# EAGLE schematic ModuleCarrier-Murata-ABZ-v1.0.0 (EAGLE 7.7.0)

## Sheet 1 of 2
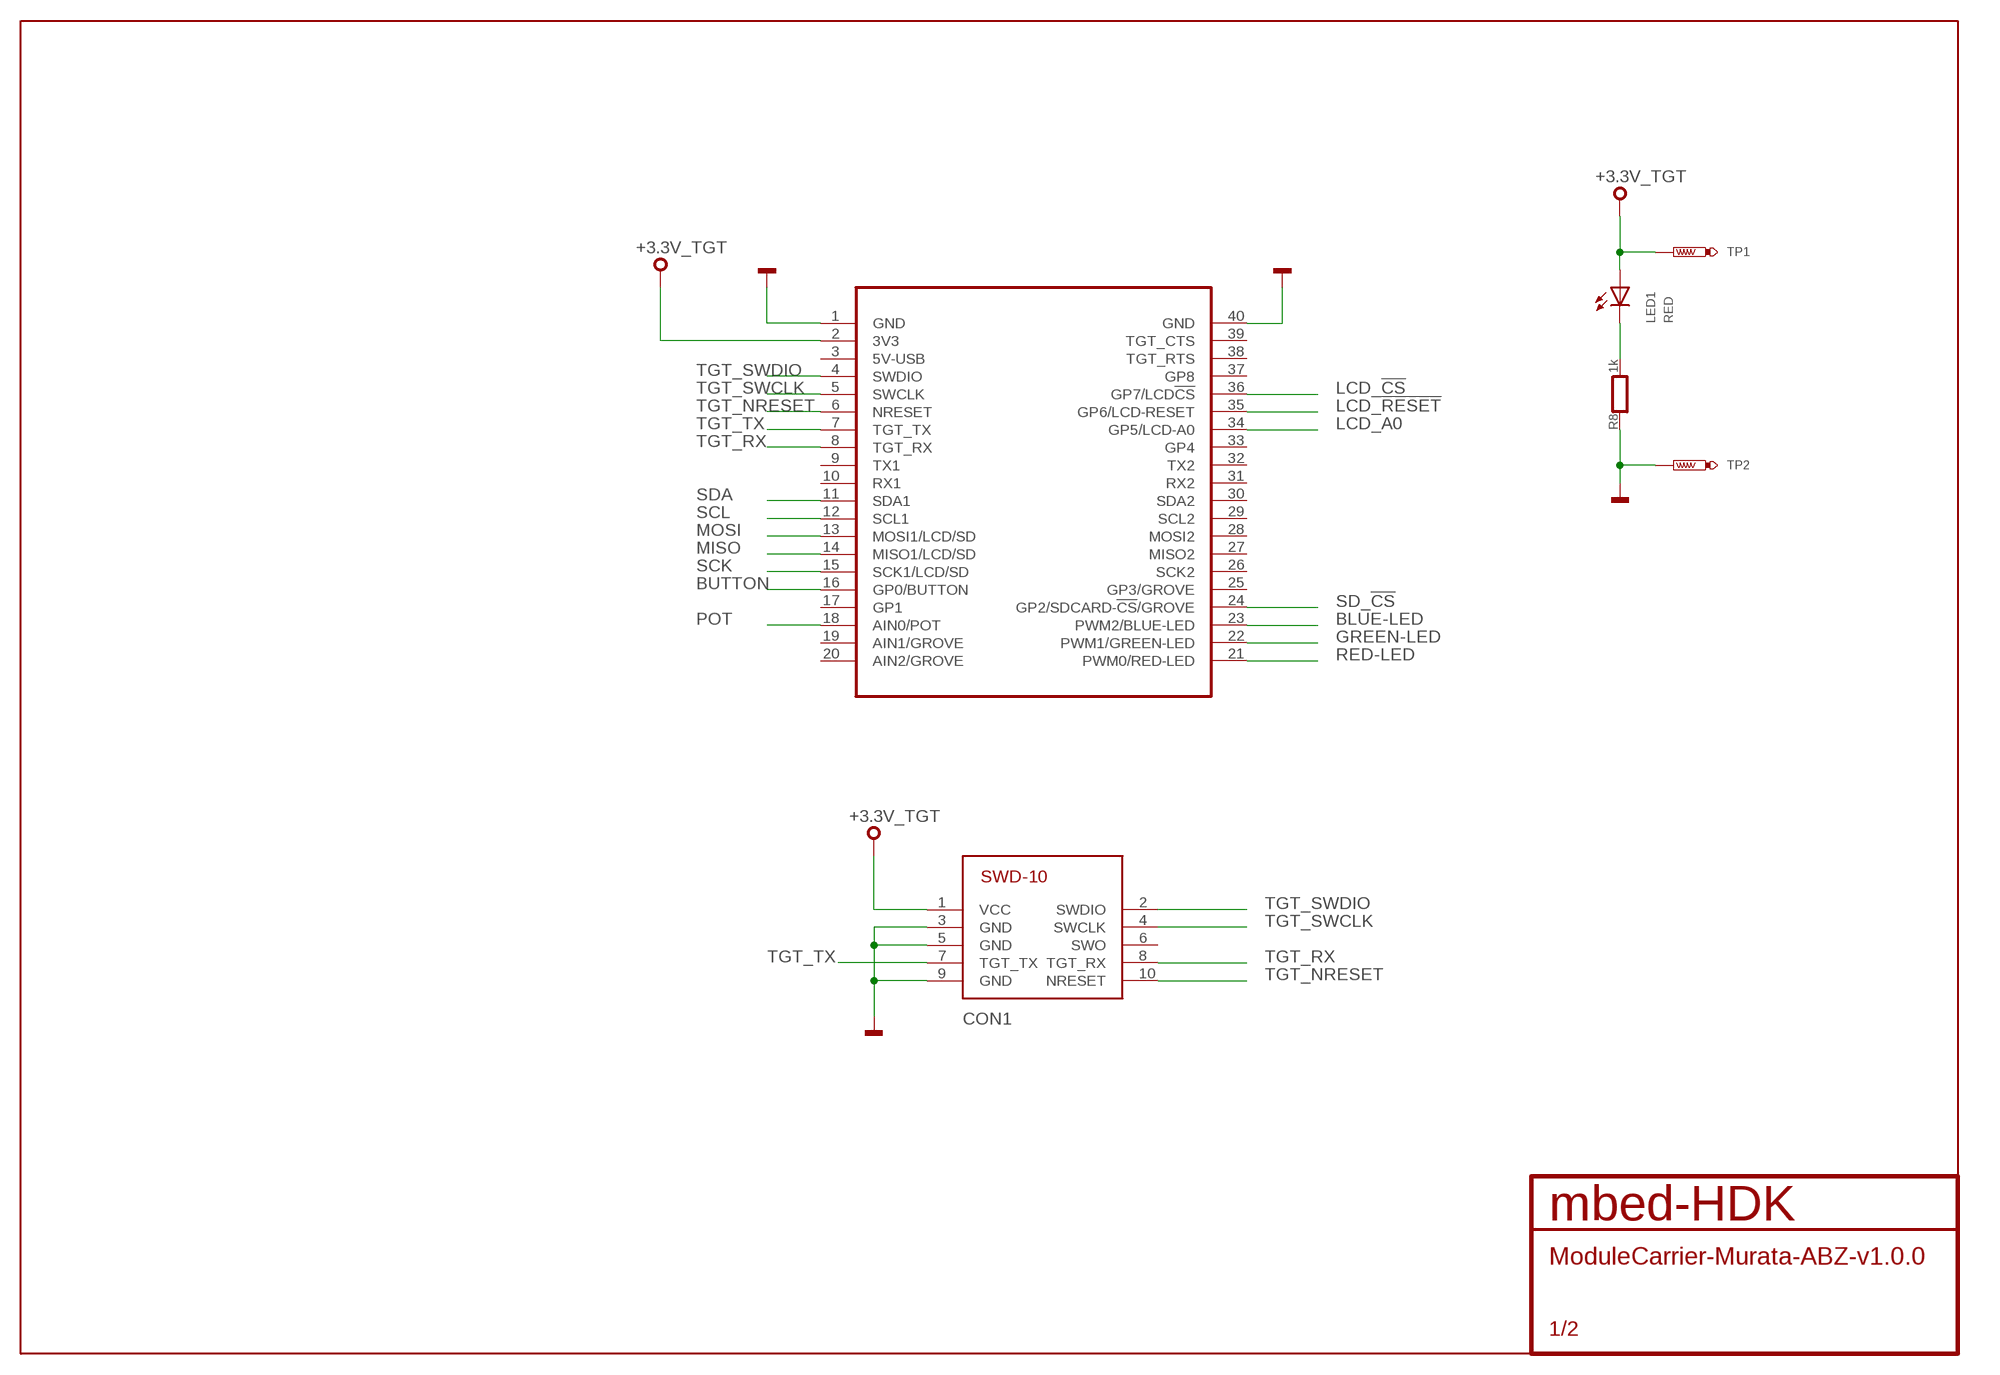
[diagram p0: schematic, sheet 1]

### Parts
CON1  SWD-10/TC2050_SMD  [FTSH-105-02]
LED1  RED  SMD_LED0603  [CHIPLED_0603]
MOD1  MODULE_DAUGHTER  [MODULE_DAUGHTER]
R8  1k  RESISTOR0603  [0603]
TP1  TEST-POINT-50R-PTH  [TP50-PTH]
TP2  TEST-POINT-50R-PTH  [TP50-PTH]

### Nets
+3.3V_TGT: CON1.1(VCC) LED1.A MOD1.2(3V3) TP1.TP ; also sheet 2
BLUE-LED: MOD1.23(PWM2/BLUE-LED) ; also sheet 2
BUTTON: MOD1.16(GP0/BUTTON) ; also sheet 2
GND: CON1.3(GND) CON1.5(GND) CON1.9(GND) MOD1.1(GND) MOD1.40(GND) R8.1 TP2.TP ; also sheet 2
GREEN-LED: MOD1.22(PWM1/GREEN-LED) ; also sheet 2
LCD_!CS: MOD1.36(GP7/LCD!CS) ; also sheet 2
LCD_!RESET: MOD1.35(GP6/LCD-RESET) ; also sheet 2
LCD_A0: MOD1.34(GP5/LCD-A0) ; also sheet 2
MISO: MOD1.14(MISO1/LCD/SD) ; also sheet 2
MOSI: MOD1.13(MOSI1/LCD/SD) ; also sheet 2
PA_1: LED1.C R8.2
POT: MOD1.18(AIN0/POT) ; also sheet 2
RED-LED: MOD1.21(PWM0/RED-LED) ; also sheet 2
SCK: MOD1.15(SCK1/LCD/SD) ; also sheet 2
SCL: MOD1.12(SCL1) ; also sheet 2
SD_!CS: MOD1.24(GP2/SDCARD-!CS!/GROVE) ; also sheet 2
SDA: MOD1.11(SDA1) ; also sheet 2
TGT_NRESET: CON1.10(NRESET) MOD1.6(NRESET) ; also sheet 2
TGT_RX: CON1.8(TGT_RX) MOD1.8(TGT_RX) ; also sheet 2
TGT_SWCLK: CON1.4(SWCLK) MOD1.5(SWCLK) ; also sheet 2
TGT_SWDIO: CON1.2(SWDIO) MOD1.4(SWDIO) ; also sheet 2
TGT_TX: CON1.7(TGT_TX) MOD1.7(TGT_TX) ; also sheet 2
Unconnected: CON1.6(SWO) MOD1.3(5V-USB) MOD1.9(TX1) MOD1.10(RX1) MOD1.17(GP1) MOD1.19(AIN1/GROVE) MOD1.20(AIN2/GROVE) MOD1.25(GP3/GROVE) MOD1.26(SCK2) MOD1.27(MISO2) MOD1.28(MOSI2) MOD1.29(SCL2) MOD1.30(SDA2) MOD1.31(RX2) MOD1.32(TX2) MOD1.33(GP4) MOD1.37(GP8) MOD1.38(TGT_RTS) MOD1.39(TGT_CTS)

## Sheet 2 of 2
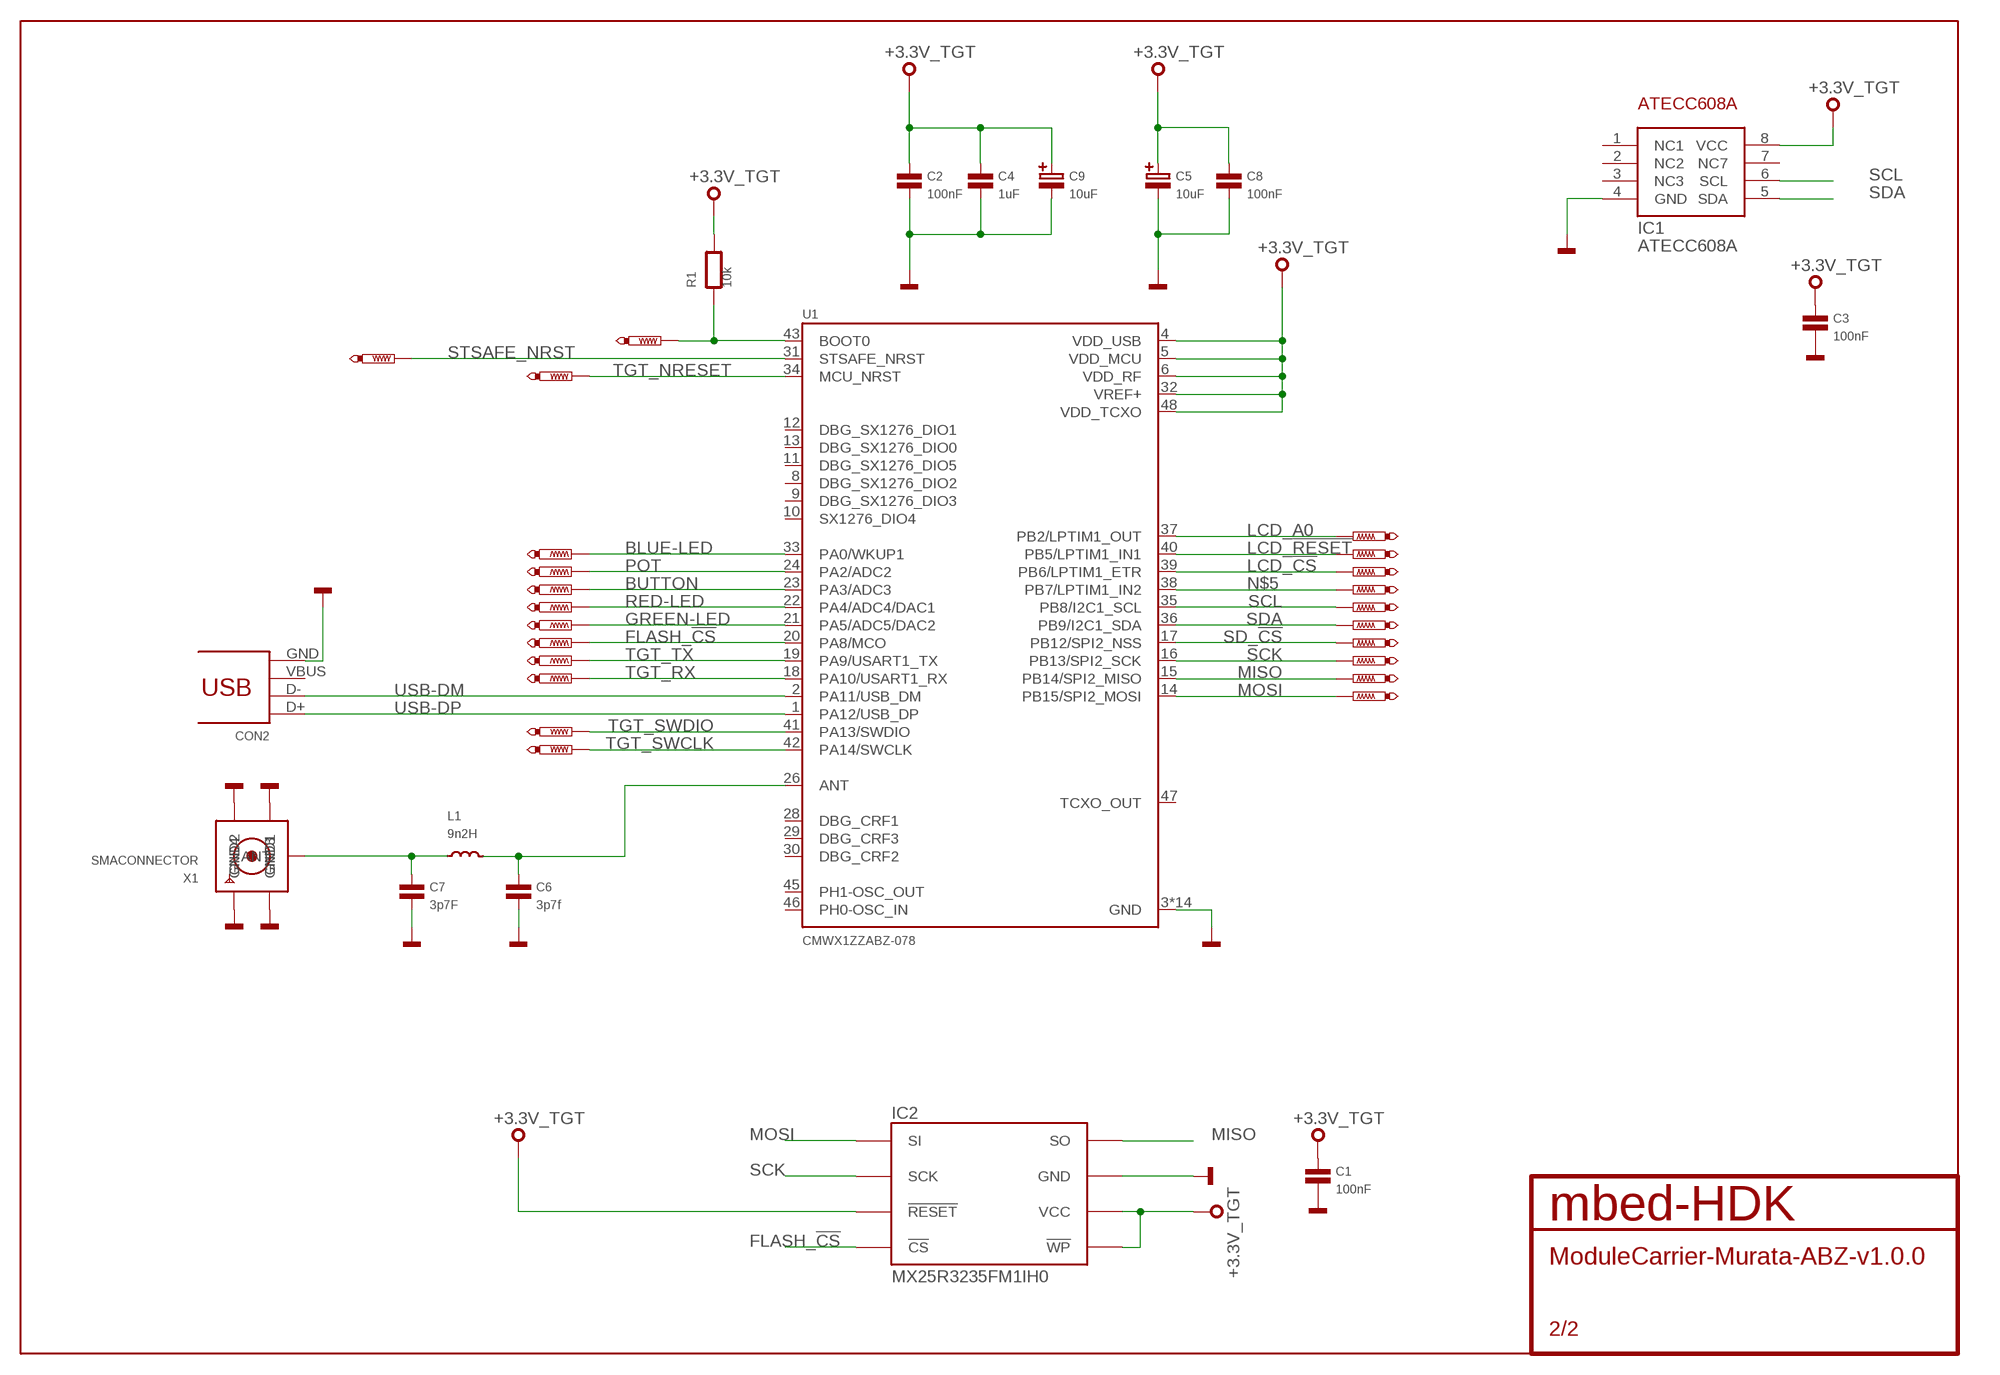
[diagram p1: schematic, sheet 2]

### Parts
C1  100nF  CAPACITOR0603  [0603]
C2  100nF  CAPACITOR0603  [0603]
C3  100nF  CAPACITOR0603  [0603]
C4  1uF  CAPACITOR0603  [0603]
C5  10uF  CAPACITOR-POLARISEDB  [SMC_B]
C6  3p7f  CAPACITOR0603  [0603]
C7  3p7F  CAPACITOR0603  [0603]
C8  100nF  CAPACITOR0603  [0603]
C9  10uF  CAPACITOR-POLARISEDB  [SMC_B]
CON2  10033526-N3212MLF  [USB-MINI-B-H]
IC1  ATECC608A  [SO8]
IC2  MX25R3235FM1IH0  [SO8]
L1  9n2H  INDUCTOR0603  [0603]
R1  10k  RESISTOR0603  [0603]
TP3  PTR1TP08R  [TP08R]
TP4  PTR1TP08R  [TP08R]
TP5  PTR1TP08R  [TP08R]
TP6  PTR1TP08R  [TP08R]
TP7  PTR1TP08R  [TP08R]
TP8  PTR1TP08R  [TP08R]
TP9  PTR1TP08R  [TP08R]
TP10  PTR1TP08R  [TP08R]
TP11  PTR1TP08R  [TP08R]
TP12  PTR1TP08R  [TP08R]
TP13  PTR1TP08R  [TP08R]
TP14  PTR1TP08R  [TP08R]
TP15  PTR1TP08R  [TP08R]
TP21  PTR1TP08R  [TP08R]
TP22  PTR1TP08R  [TP08R]
TP23  PTR1TP08R  [TP08R]
TP24  PTR1TP08R  [TP08R]
TP25  PTR1TP08R  [TP08R]
TP26  PTR1TP08R  [TP08R]
TP27  PTR1TP08R  [TP08R]
TP28  PTR1TP08R  [TP08R]
TP29  PTR1TP08R  [TP08R]
TP30  PTR1TP08R  [TP08R]
U1  CMWX1ZZABZ-078  [XCVR_CMWX1ZZABZ-078]
X1  SMACONNECTOR  [SMA90_DIP]

### Nets
+3.3V_TGT: C1.1 C2.1 C3.1 C4.1 C5.+ C8.1 C9.+ IC1.8(VCC) IC2.3(!WP) IC2.7(!RESET) IC2.8(VCC) R1.2 U1.4(VDD_USB) U1.5(VDD_MCU) U1.6(VDD_RF) U1.32(VREF+) U1.48(VDD_TCXO) ; also sheet 1
BLUE-LED: TP30.TP U1.33(PA0/WKUP1) ; also sheet 1
BUTTON: TP11.TP U1.23(PA3/ADC3) ; also sheet 1
FLASH_!CS: IC2.1(!CS) TP29.TP U1.20(PA8/MCO)
GND: C1.2 C2.2 C3.2 C4.2 C5.- C6.2 C7.2 C8.2 C9.- CON2.GND IC1.4(GND) IC2.4(GND) U1.3(GND) U1.7(GND) U1.25(GND) U1.27(GND) U1.44(GND) U1.49(GND) U1.50(GND) U1.51(GND) U1.52(GND) U1.53(GND) U1.54(GND) U1.55(GND) U1.56(GND) U1.57(GND) X1.GND1 X1.GND2 X1.GND3 X1.GND4 ; also sheet 1
GREEN-LED: TP28.TP U1.21(PA5/ADC5/DAC2) ; also sheet 1
LCD_!CS: TP25.TP U1.39(PB6/LPTIM1_ETR) ; also sheet 1
LCD_!RESET: TP7.TP U1.40(PB5/LPTIM1_IN1) ; also sheet 1
LCD_A0: TP6.TP U1.37(PB2/LPTIM1_OUT) ; also sheet 1
MISO: IC2.2(SO) TP5.TP U1.15(PB14/SPI2_MISO) ; also sheet 1
MOSI: IC2.5(SI) TP4.TP U1.14(PB15/SPI2_MOSI) ; also sheet 1
N$4: R1.1 TP14.TP U1.43(BOOT0)
N$5: TP26.TP U1.38(PB7/LPTIM1_IN2)
N$7: C7.1 L1.1 X1.ANTENNA(ANT)
N$8: C6.1 L1.2 U1.26(ANT)
POT: TP10.TP U1.24(PA2/ADC2) ; also sheet 1
RED-LED: TP24.TP U1.22(PA4/ADC4/DAC1) ; also sheet 1
SCK: IC2.6(SCK) TP3.TP U1.16(PB13/SPI2_SCK) ; also sheet 1
SCL: IC1.6(SCL) TP12.TP U1.35(PB8/I2C1_SCL) ; also sheet 1
SD_!CS: TP27.TP U1.17(PB12/SPI2_NSS) ; also sheet 1
SDA: IC1.5(SDA) TP13.TP U1.36(PB9/I2C1_SDA) ; also sheet 1
STSAFE_NRST: TP15.TP U1.31(STSAFE_NRST)
TGT_NRESET: TP21.TP U1.34(MCU_NRST) ; also sheet 1
TGT_RX: TP9.TP U1.18(PA10/USART1_RX) ; also sheet 1
TGT_SWCLK: TP22.TP U1.42(PA14/SWCLK) ; also sheet 1
TGT_SWDIO: TP23.TP U1.41(PA13/SWDIO) ; also sheet 1
TGT_TX: TP8.TP U1.19(PA9/USART1_TX) ; also sheet 1
USB-DM: CON2.D- U1.2(PA11/USB_DM)
USB-DP: CON2.D+ U1.1(PA12/USB_DP)
Unconnected: CON2.VBUS IC1.1(NC1) IC1.2(NC2) IC1.3(NC3) IC1.7(NC7) U1.8(DBG_SX1276_DIO2) U1.9(DBG_SX1276_DIO3) U1.10(SX1276_DIO4) U1.11(DBG_SX1276_DIO5) U1.12(DBG_SX1276_DIO1) U1.13(DBG_SX1276_DIO0) U1.28(DBG_CRF1) U1.29(DBG_CRF3) U1.30(DBG_CRF2) U1.45(PH1-OSC_OUT) U1.46(PH0-OSC_IN) U1.47(TCXO_OUT)

## Library data of the parts
C1-C4 C6-C8 = mbed-HDK-RLC:CAPACITOR: Capacitor
C5 C9 = mbed-HDK-RLC:CAPACITOR-POLARISED: Polarised capacitor; MF: Kemet; MFN: T491B106K020AT; OC-DIGIKEY: 399-8298-1-ND; OC-MOUSER: 80-T491B106K020; OC-NEWARK: 57K1740
CON1 = mbed-HDK-Connector:SWD-10/TC2050: 1mm pitch 10-Pin Cortex Programming Header with optional TC2050 footprint solderless interchangeable
CON2 = mbed-HDK-Connector:10033526-N3212MLF: USB Receptacle Horizontal Mini Type B; MF: Amphenol FCI; MFN: 10033526-N3212MLF; OC-DIGIKEY: 609-4701-1-ND; OC-MOUSER: 649-10033526N3212MLF; OC-NEWARK: 14N2224
IC1 = blackbriar:ATECC608A
IC2 = blackbriar:MX25R3235FM1IH0: Serial Flash 32 Mb 80 Mhz; MF: Macronix; MFN: MX25R3235FM2IH0; OC-DIGIKEY: 1092-1174-ND
L1 = mbed-HDK-RLC:INDUCTOR: Inductor
LED1 = mbed-HDK-Optical:SMD_LED: LED SMD, Colour Red; MF: Wurth Electronics Inc; MFN: 150060RS75000; OC-DIGIKEY: 732-4978-1-ND; OC-MOUSER: 710-150060RS75000; OC-NEWARK: 2322071
MOD1 = blackbriar:MODULE_DAUGHTER
R1 R8 = mbed-HDK-RLC:RESISTOR: Resistor
TP1 TP2 = mbed-HDK:TEST-POINT
TP3-TP15 TP21-TP30 = blackbriar:PTR1: TEST PIN
U1 = CMWX1ZZABZ-078:CMWX1ZZABZ-078: RF MODULE 860-930MHz 12.5x11.6x1.76mm 3.3Vdc; AVAILABILITY: Good; DESCRIPTION: RF MODULE 860-930MHz 12.5x11.6x1.76mm 3.3Vdc; MF: Murata; MP: CMWX1ZZABZ-078; PACKAGE: Module Murata; PRICE: 13.62 USD
X1 = SMACONNECTOR:SMACONNECTOR: SMA Connector 90° DIP SMA Connector, 50 Ohm (4UConnector: 07259); AVAILABILITY: Good; DESCRIPTION: CONNECTOR, SMA, ANTENNA; SVHC: No SVHC (19-Dec-2012); For Use With: Antenna; Kit Contents: SMA Connector; MF: LPRS; MP: SMA CONNECTOR; PACKAGE: None; PRICE: 1.06 USD